# Altium schematic sheet AMU-S27-V00-MX120G-Interface.SchDoc
size A3; SheetNumber: 23; SheetTotal: 25
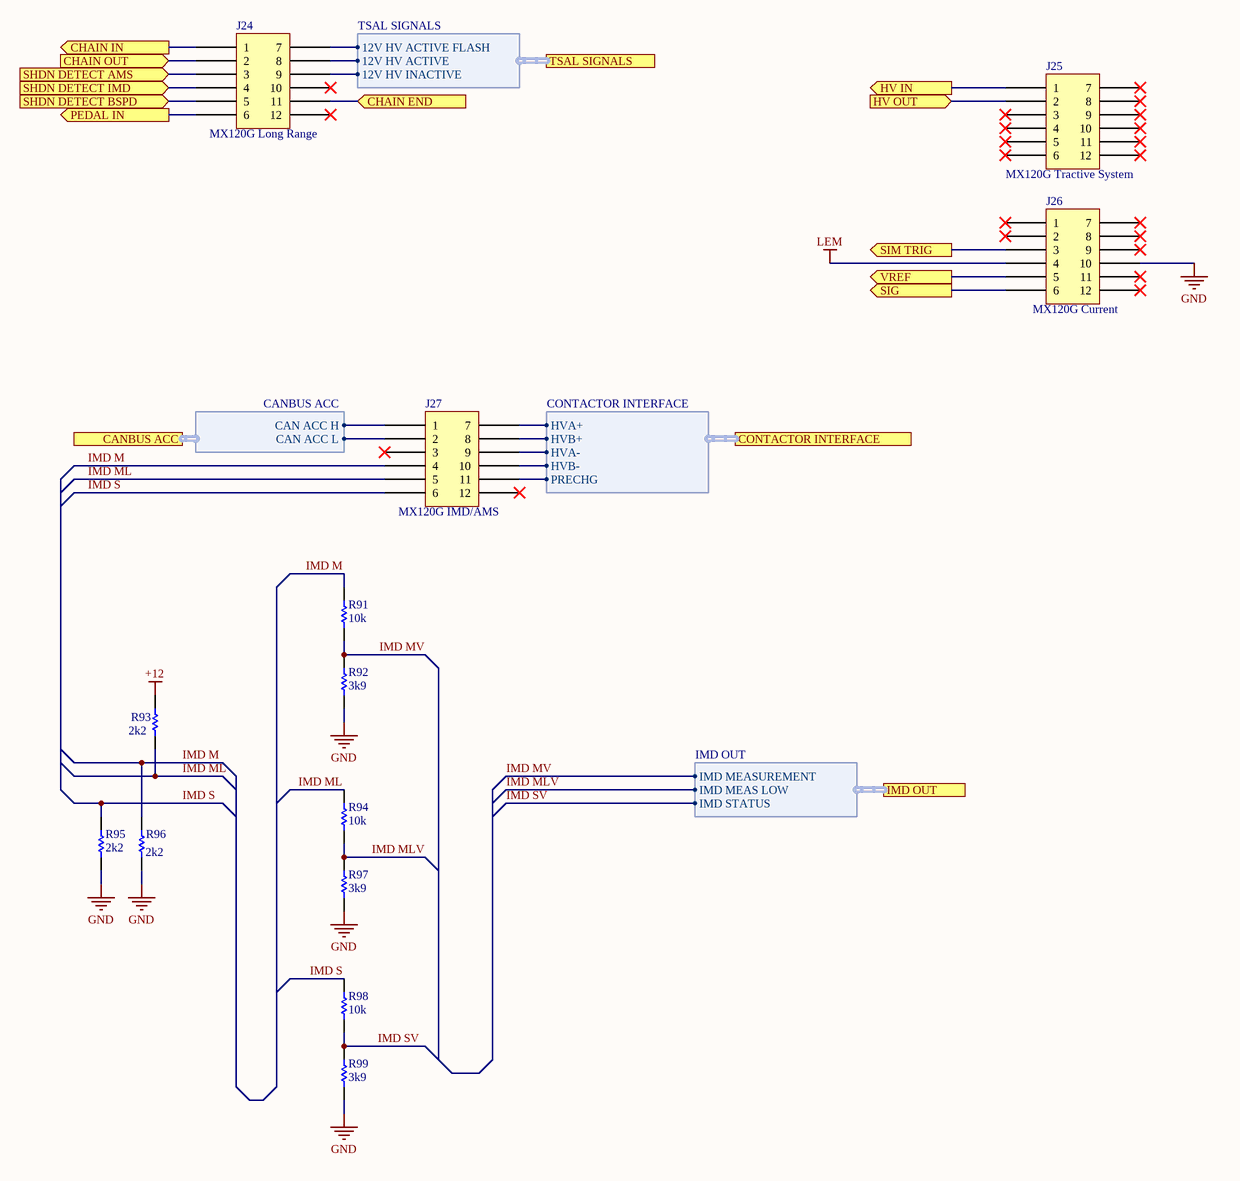
[diagram p0: AMU-S27-V00-MX120G-Interface.SchDoc]

## Parts
J24  MX120G Long Range  [MX120G]
J25  MX120G Tractive System  [MX120G]
J26  MX120G Current  [MX120G]
J27  MX120G IMD/AMS  [MX120G]
R91  10k  [Res_ThinFilm_0603]
R92  3k9  [Res_ThinFilm_0603]
R93  2k2  [Res_ThinFilm_0603]
R94  10k  [Res_ThinFilm_0603]
R95  2k2  [Res_ThinFilm_0603]
R96  2k2  [Res_ThinFilm_0603]
R97  3k9  [Res_ThinFilm_0603]
R98  10k  [Res_ThinFilm_0603]
R99  3k9  [Res_ThinFilm_0603]

## Ports
CANBUS ACC (harness CANBUS ACC), CHAIN END (in), CHAIN IN (out), CHAIN OUT (in), CONTACTOR INTERFACE (harness CONTACTOR INTERFACE), HV IN (out), HV OUT (in), IMD OUT (harness IMD OUT), PEDAL IN (out), SHDN DETECT AMS (in), SHDN DETECT BSPD (in), SHDN DETECT IMD (in), SIG (out), SIM TRIG (out), TSAL SIGNALS (harness TSAL SIGNALS), VREF (out)

## Harnesses
CONTACTOR INTERFACE: HVA-, HVB+, HVA+, HVB-, PRECHG
IMD OUT: IMD MEASUREMENT, IMD MEAS LOW, IMD STATUS
TSAL SIGNALS: 12V HV INACTIVE, 12V HV ACTIVE, 12V HV ACTIVE FLASH
CANBUS ACC: CAN ACC H, CAN ACC L

## Nets
+12: R93.2
GND: J26.10 R92.1 R95.1 R96.1 R97.1 R99.1
LEM: J26.4
CHAIN END: J24.11 ; port CHAIN END
CHAIN IN: J24.1 ; port CHAIN IN
CHAIN OUT: J24.2 ; port CHAIN OUT
HV IN: J25.1 ; port HV IN
HV OUT: J25.2 ; port HV OUT
IMD M: J27.4 R91.2 R96.2
IMD ML: J27.5 R93.1 R94.2
IMD MLV: R94.1 R97.2 ; port IMD OUT.IMD MEAS LOW
IMD MV: R91.1 R92.2 ; port IMD OUT.IMD MEASUREMENT
IMD S: J27.6 R95.2 R98.2
IMD SV: R98.1 R99.2 ; port IMD OUT.IMD STATUS
PEDAL IN: J24.6 ; port PEDAL IN
SHDN DETECT AMS: J24.3 ; port SHDN DETECT AMS
SHDN DETECT BSPD: J24.5 ; port SHDN DETECT BSPD
SHDN DETECT IMD: J24.4 ; port SHDN DETECT IMD
SIG: J26.6 ; port SIG
SIM TRIG: J26.3 ; port SIM TRIG
VREF: J26.5 ; port VREF
NetJ24_7: J24.7 ; port TSAL SIGNALS.12V HV ACTIVE FLASH
NetJ24_8: J24.8 ; port TSAL SIGNALS.12V HV ACTIVE
NetJ24_9: J24.9 ; port TSAL SIGNALS.12V HV INACTIVE
NetJ27_1: J27.1 ; port CANBUS ACC.CAN ACC H
NetJ27_2: J27.2 ; port CANBUS ACC.CAN ACC L
NetJ27_7: J27.7 ; port CONTACTOR INTERFACE.HVA+
NetJ27_8: J27.8 ; port CONTACTOR INTERFACE.HVB+
NetJ27_9: J27.9 ; port CONTACTOR INTERFACE.HVA-
NetJ27_10: J27.10 ; port CONTACTOR INTERFACE.HVB-
NetJ27_11: J27.11 ; port CONTACTOR INTERFACE.PRECHG

Not connected (* = marked no-connect by the designer): J24 10* 12*; J25 3* 4* 5* 6* 7* 8* 9* 10* 11* 12*; J26 1* 2* 7* 8* 9* 11* 12*; J27 3* 12*

## Library data of the parts
J24-J27 = MX120G: MX120G with standard connector layout
R91 R94 R98 = 10k 1% 0603: Resistor, SMD, 10k, 0.1W, 1%, 0603
R92 R97 R99 = 3k9 5% 0603: Resistor, SMD, 3k9, 0.1W, 5%, 0603
R93 R95 R96 = 2k2 5% 0603: Resistor, SMD, 2k2, 0.1W, 5%, 0603